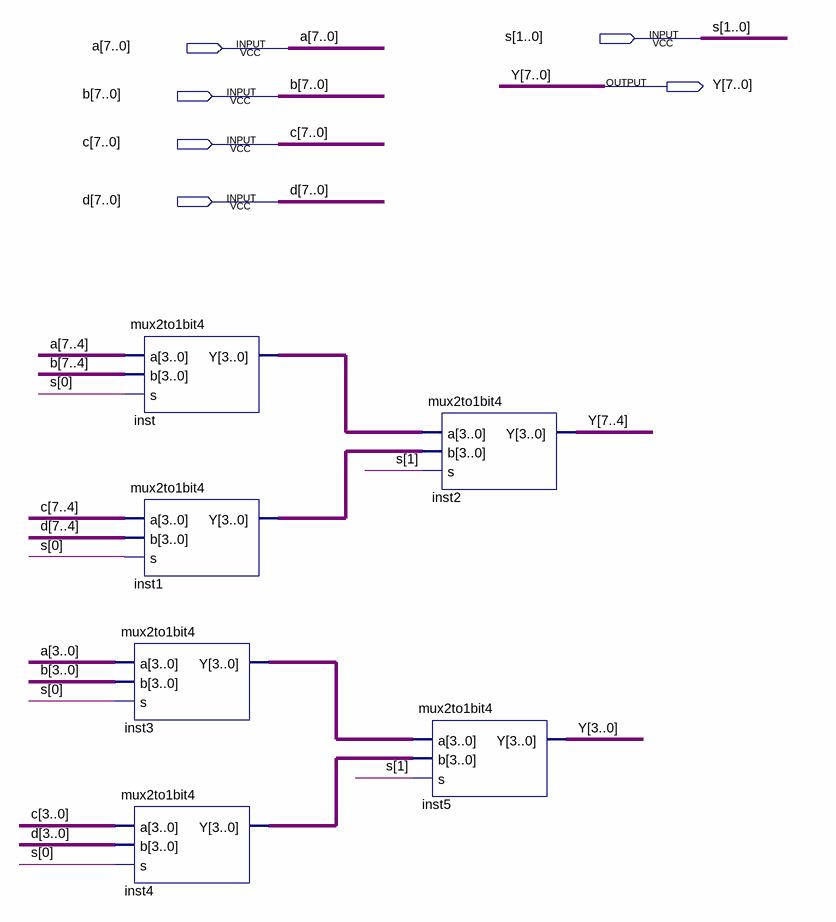
[diagram p0: schematic sheet]
// Quartus schematic mux4to1bit8.bdf as structural Verilog: 6 symbols, 6 pins
module mux4to1bit8 (
  input  [1:0] s,
  input  [7:0] a,
  input  [7:0] b,
  input  [7:0] c,
  input  [7:0] d,
  output [7:0] Y
);

  wire [3:0] inst1_y, inst3_y, inst4_y, inst_y;

  mux2to1bit4 inst (.a(a[7:4]), .b(b[7:4]), .s(s[0]), .Y(inst_y));
  mux2to1bit4 inst1 (.a(c[7:4]), .b(d[7:4]), .s(s[0]), .Y(inst1_y));
  mux2to1bit4 inst3 (.a(a[3:0]), .b(b[3:0]), .s(s[0]), .Y(inst3_y));
  mux2to1bit4 inst4 (.a(c[3:0]), .b(d[3:0]), .s(s[0]), .Y(inst4_y));
  mux2to1bit4 inst2 (.a(inst_y), .b(inst1_y), .s(s[1]), .Y(Y[7:4]));
  mux2to1bit4 inst5 (.a(inst3_y), .b(inst4_y), .s(s[1]), .Y(Y[3:0]));
endmodule
